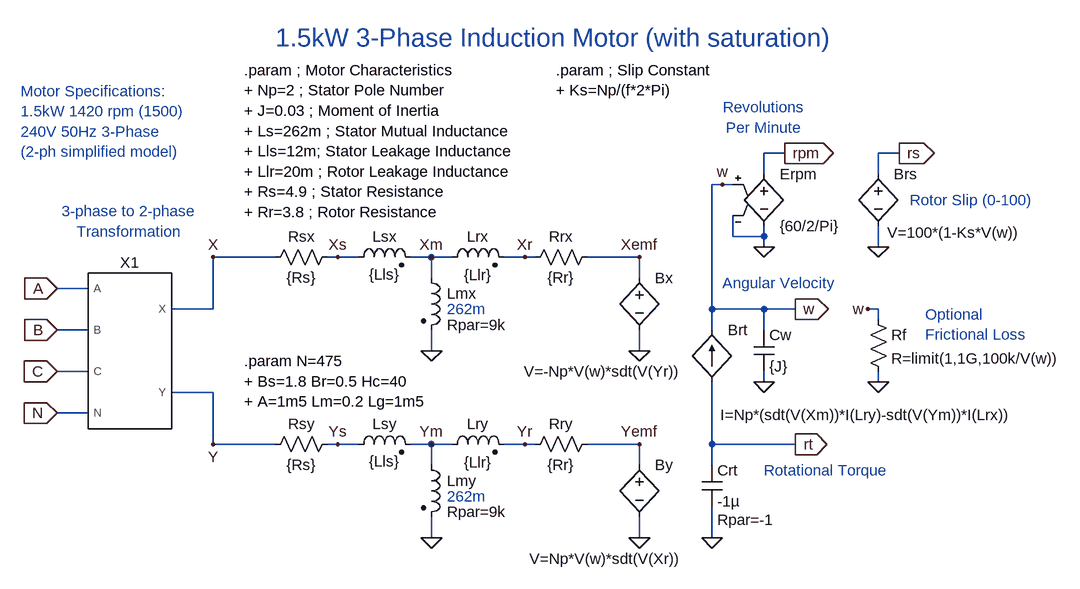
[diagram p0: schematic 3-PhaseMotor.asc]
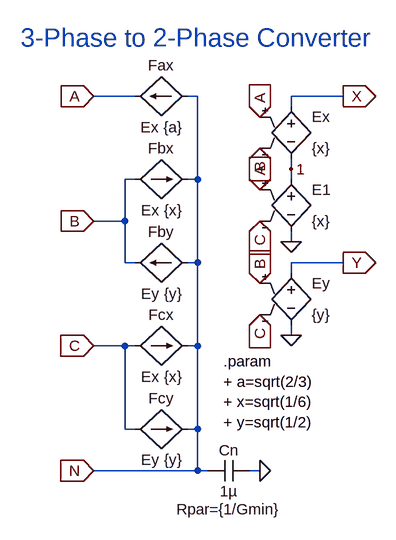
[diagram p1: sub-circuit 3to2xfmr.asc]
3-PhaseMotor.asc, the LTspice schematic file:
Version 4
SHEET 1 1896 836
WIRE 704 -96 672 -96
WIRE 880 -96 848 -96
WIRE 672 -64 672 -96
WIRE 848 -64 848 -96
WIRE 608 -48 592 -48
WIRE 624 -48 608 -48
WIRE 624 32 624 0
WIRE 672 32 672 16
WIRE 672 32 624 32
WIRE 672 48 672 32
WIRE 848 48 848 16
WIRE -80 64 -176 64
WIRE 16 64 0 64
WIRE 48 64 16 64
WIRE 160 64 128 64
WIRE 192 64 160 64
WIRE 304 64 272 64
WIRE 320 64 304 64
WIRE 480 64 400 64
WIRE 160 96 160 64
WIRE 480 96 480 64
WIRE -368 112 -416 112
WIRE -176 144 -176 64
WIRE -176 144 -240 144
WIRE 592 144 592 -48
WIRE 672 144 592 144
WIRE 720 144 672 144
WIRE 848 144 832 144
WIRE 848 160 848 144
WIRE -368 176 -416 176
WIRE 592 176 592 144
WIRE 672 176 672 144
WIRE 160 208 160 176
WIRE 480 208 480 176
WIRE -368 240 -416 240
WIRE 672 256 672 240
WIRE 848 256 848 240
WIRE -176 272 -240 272
WIRE -368 304 -416 304
WIRE -176 352 -176 272
WIRE -80 352 -176 352
WIRE 16 352 0 352
WIRE 48 352 16 352
WIRE 160 352 128 352
WIRE 192 352 160 352
WIRE 304 352 272 352
WIRE 320 352 304 352
WIRE 480 352 400 352
WIRE 592 352 592 256
WIRE 720 352 592 352
WIRE 160 384 160 352
WIRE 480 384 480 352
WIRE 592 384 592 352
WIRE 160 496 160 464
WIRE 480 496 480 464
WIRE 592 496 592 448
FLAG 160 496 0
FLAG 160 208 0
FLAG 704 -96 rpm
IOPIN 704 -96 Out
FLAG 720 144 w
IOPIN 720 144 Out
FLAG 720 352 rt
IOPIN 720 352 Out
FLAG 480 208 0
FLAG 480 496 0
FLAG 608 -48 w
FLAG 672 48 0
FLAG 672 256 0
FLAG 592 496 0
FLAG 160 64 Xm
FLAG 304 64 Xr
FLAG 160 352 Ym
FLAG 304 352 Yr
FLAG 16 64 Xs
FLAG 16 352 Ys
FLAG 480 64 Xemf
FLAG 480 352 Yemf
FLAG 848 48 0
FLAG 880 -96 rs
IOPIN 880 -96 Out
FLAG 832 144 w
FLAG 848 256 0
FLAG -176 64 X
FLAG -176 352 Y
FLAG -416 112 A
IOPIN -416 112 In
FLAG -416 176 B
IOPIN -416 176 In
FLAG -416 240 C
IOPIN -416 240 In
FLAG -416 304 N
IOPIN -416 304 In
SYMBOL res -96 80 R270
WINDOW 0 32 56 VTop 2
WINDOW 3 0 56 VBottom 2
SYMATTR InstName Rsx
SYMATTR Value {Rs}
SYMBOL ind2 32 80 R270
WINDOW 0 32 56 VTop 2
WINDOW 3 5 56 VBottom 2
SYMATTR InstName Lsx
SYMATTR Value {Lls}
SYMATTR Type ind
SYMATTR SpiceLine Rser=0
SYMBOL ind2 144 80 R0
WINDOW 0 40 40 Left 2
WINDOW 3 0 64 Invisible 2
WINDOW 39 40 88 Left 2
SYMATTR InstName Lmx
SYMATTR Value Bs={Bs} Br={Br} Hc={Hc} A={A} Lm={Lm} Lg={Lg} N={N}
SYMATTR SpiceLine Rpar=9k
SYMATTR Type ind
SYMBOL ind2 176 80 R270
WINDOW 0 32 56 VTop 2
WINDOW 3 4 56 VBottom 2
SYMATTR InstName Lrx
SYMATTR Value {Llr}
SYMATTR Type ind
SYMATTR SpiceLine Rser=0
SYMBOL res 304 80 R270
WINDOW 0 32 56 VTop 2
WINDOW 3 0 56 VBottom 2
SYMATTR InstName Rrx
SYMATTR Value {Rr}
SYMBOL bv 480 80 R0
WINDOW 3 64 160 Right 2
SYMATTR Value V=-Np*V(w)*sdt(V(Yr))
SYMATTR InstName Bx
SYMBOL res -96 368 R270
WINDOW 0 32 56 VTop 2
WINDOW 3 0 56 VBottom 2
SYMATTR InstName Rsy
SYMATTR Value {Rs}
SYMBOL ind2 32 368 R270
WINDOW 0 32 56 VTop 2
WINDOW 3 5 56 VBottom 2
SYMATTR InstName Lsy
SYMATTR Value {Lls}
SYMATTR Type ind
SYMATTR SpiceLine Rser=0
SYMBOL ind2 144 368 R0
WINDOW 0 40 40 Left 2
WINDOW 3 0 64 Invisible 2
WINDOW 39 40 88 Left 2
SYMATTR InstName Lmy
SYMATTR Value Bs={Bs} Br={Br} Hc={Hc} A={A} Lm={Lm} Lg={Lg} N={N}
SYMATTR SpiceLine Rpar=9k
SYMATTR Type ind
SYMBOL ind2 176 368 R270
WINDOW 0 32 56 VTop 2
WINDOW 3 4 56 VBottom 2
SYMATTR InstName Lry
SYMATTR Value {Llr}
SYMATTR Type ind
SYMATTR SpiceLine Rser=0
SYMBOL res 304 368 R270
WINDOW 0 32 56 VTop 2
WINDOW 3 0 56 VBottom 2
SYMATTR InstName Rry
SYMATTR Value {Rr}
SYMBOL bv 480 368 R0
WINDOW 3 64 160 Right 2
SYMATTR Value V=Np*V(w)*sdt(V(Xr))
SYMATTR InstName By
SYMBOL bi 592 256 M180
WINDOW 0 24 80 Left 2
WINDOW 3 13 -51 Left 2
SYMATTR InstName Brt
SYMATTR Value I=Np*(sdt(V(Xm))*I(Lry)-sdt(V(Ym))*I(Lrx))
SYMBOL cap 656 176 R0
SYMATTR InstName Cw
SYMATTR Value {J}
SYMBOL cap 576 384 R0
WINDOW 39 24 84 Left 2
SYMATTR SpiceLine Rpar=-1
SYMATTR InstName Crt
SYMATTR Value -1µ
SYMBOL res 832 144 R0
SYMATTR InstName Rf
SYMATTR Value R=limit(1,1G,100k/V(w))
SYMBOL e 672 -80 R0
SYMATTR InstName Erpm
SYMATTR Value {60/2/Pi}
SYMBOL bv 848 -80 R0
WINDOW 3 14 106 Left 2
SYMATTR Value V=100*(1-Ks*V(w))
SYMATTR InstName Brs
SYMBOL 3to2xfmr -304 208 R0
SYMATTR InstName X1
TEXT 352 -248 Bottom 4 ;1.5kW 3-Phase Induction Motor (with saturation)
TEXT -472 -192 Left 2 ;Motor Specifications:\n1.5kW 1420 rpm (1500)\n240V 50Hz 3-Phase\n(2-ph simplified model)
TEXT -128 -224 Left 2 !.param ; Motor Characteristics\n+ Np=2 ; Stator Pole Number\n+ J=0.03 ; Moment of Inertia\n+ Ls=262m ; Stator Mutual Inductance\n+ Lls=12m; Stator Leakage Inductance\n+ Llr=20m ; Rotor Leakage Inductance\n+ Rs=4.9 ; Stator Resistance\n+ Rr=3.8 ; Rotor Resistance
TEXT -128 224 Left 2 !.param N=475\n+ Bs=1.8 Br=0.5 Hc=40\n+ A=1m5 Lm=0.2 Lg=1m5
TEXT 352 -224 Left 2 !.param ; Slip Constant\n+ Ks=Np/(f*2*Pi)
TEXT 184 144 Left 2 ;262m
TEXT 184 432 Left 2 ;262m
TEXT 608 104 Left 2 ;Angular Velocity
TEXT 672 392 Left 2 ;Rotational Torque
TEXT 672 -120 Bottom 2 ;Revolutions\nPer Minute
TEXT 896 -24 Left 2 ;Rotor Slip (0-100)
TEXT 920 152 Left 2 ;Optional\nFrictional Loss
TEXT -304 40 Bottom 2 ;3-phase to 2-phase\nTransformation

3to2xfmr.asc, the sub-circuit schematic file:
Version 4
SHEET 1 880 680
WIRE 112 -304 48 -304
WIRE 208 -304 192 -304
WIRE 432 -304 352 -304
WIRE 352 -288 352 -304
WIRE 352 -192 352 -208
WIRE 112 -176 96 -176
WIRE 208 -176 208 -304
WIRE 208 -176 192 -176
WIRE 352 -176 352 -192
WIRE 96 -112 96 -176
WIRE 96 -112 48 -112
WIRE 352 -80 352 -96
WIRE 96 -48 96 -112
WIRE 112 -48 96 -48
WIRE 208 -48 208 -176
WIRE 208 -48 192 -48
WIRE 432 -48 352 -48
WIRE 352 -32 352 -48
WIRE 352 64 352 48
WIRE 96 80 48 80
WIRE 112 80 96 80
WIRE 208 80 208 -48
WIRE 208 80 192 80
WIRE 96 208 96 80
WIRE 112 208 96 208
WIRE 208 208 208 80
WIRE 208 208 192 208
WIRE 208 272 208 208
WIRE 208 272 48 272
WIRE 224 272 208 272
WIRE 304 272 288 272
FLAG 48 -304 A
IOPIN 48 -304 In
FLAG 48 -112 B
IOPIN 48 -112 In
FLAG 48 80 C
IOPIN 48 80 In
FLAG 352 -80 0
FLAG 304 272 0
FLAG 432 -304 X
IOPIN 432 -304 Out
FLAG 432 -48 Y
IOPIN 432 -48 Out
FLAG 48 272 N
IOPIN 48 272 In
FLAG 304 -272 A
IOPIN 304 -272 In
FLAG 304 -224 B
IOPIN 304 -224 In
FLAG 304 -112 C
IOPIN 304 -112 In
FLAG 304 -16 B
IOPIN 304 -16 In
FLAG 304 32 C
IOPIN 304 32 In
FLAG 304 -160 A
IOPIN 304 -160 In
FLAG 352 64 0
FLAG 352 -192 1
SYMBOL f 192 -304 M270
WINDOW 0 32 40 VTop 2
WINDOW 3 -32 40 VBottom 2
SYMATTR InstName Fax
SYMATTR Value Ex {a}
SYMBOL f 112 -176 R270
WINDOW 0 32 40 VTop 2
WINDOW 3 -32 40 VBottom 2
SYMATTR InstName Fbx
SYMATTR Value Ex {x}
SYMBOL f 192 -48 M270
WINDOW 0 32 40 VTop 2
WINDOW 3 -32 40 VBottom 2
SYMATTR InstName Fby
SYMATTR Value Ey {y}
SYMBOL f 112 80 R270
WINDOW 0 32 40 VTop 2
WINDOW 3 -32 40 VBottom 2
SYMATTR InstName Fcx
SYMATTR Value Ex {x}
SYMBOL f 112 208 R270
WINDOW 0 32 40 VTop 2
WINDOW 3 -32 40 VBottom 2
SYMATTR InstName Fcy
SYMATTR Value Ey {y}
SYMBOL e 352 -304 R0
WINDOW 0 32 32 Left 2
WINDOW 3 32 80 Left 2
SYMATTR InstName Ex
SYMATTR Value {x}
SYMBOL e 352 -192 R0
WINDOW 0 32 32 Left 2
WINDOW 3 32 80 Left 2
SYMATTR InstName E1
SYMATTR Value {x}
SYMBOL e 352 -48 R0
WINDOW 0 32 32 Left 2
WINDOW 3 32 80 Left 2
SYMATTR InstName Ey
SYMATTR Value {y}
SYMBOL cap 288 256 R90
WINDOW 0 0 32 VBottom 2
WINDOW 3 32 32 VTop 2
WINDOW 39 60 32 VTop 2
SYMATTR InstName Cn
SYMATTR Value 1µ
SYMATTR SpiceLine Rpar={1/Gmin}
TEXT 248 104 Left 2 !.param\n+ a=sqrt(2/3)\n+ x=sqrt(1/6)\n+ y=sqrt(1/2)
TEXT 208 -368 Bottom 4 ;3-Phase to 2-Phase Converter

The netlist it stands for:
* 3-PhaseMotor.asc
Rsx X Xs {Rs}
Lsx Xs Xm {Lls} Rser=0
Lmx Xm 0 Bs={Bs} Br={Br} Hc={Hc} A={A} Lm={Lm} Lg={Lg} N={N} Rpar=9k
Lrx Xm Xr {Llr} Rser=0
Rrx Xr Xemf {Rr}
Bx Xemf 0 V=-Np*V(w)*sdt(V(Yr))
Rsy Y Ys {Rs}
Lsy Ys Ym {Lls} Rser=0
Lmy Ym 0 Bs={Bs} Br={Br} Hc={Hc} A={A} Lm={Lm} Lg={Lg} N={N} Rpar=9k
Lry Ym Yr {Llr} Rser=0
Rry Yr Yemf {Rr}
By Yemf 0 V=Np*V(w)*sdt(V(Xr))
Brt rt w I=Np*(sdt(V(Xm))*I(Lry)-sdt(V(Ym))*I(Lrx))
Cw w 0 {J}
Crt rt 0 -1µ Rpar=-1
Rf w 0 R=limit(1,1G,100k/V(w))
Erpm rpm 0 w 0 {60/2/Pi}
Brs rs 0 V=100*(1-Ks*V(w))
XX1 A B C N X Y 3to2xfmr

* block symbol definitions
.subckt 3to2xfmr A B C N X Y
Fax N A Ex {a}
Fbx B N Ex {x}
Fby N B Ey {y}
Fcx C N Ex {x}
Fcy C N Ey {y}
Ex X 1 A B {x}
E1 1 0 A C {x}
Ey Y 0 B C {y}
Cn 0 N 1µ Rpar={1/Gmin}
.param
+ a=sqrt(2/3)
+ x=sqrt(1/6)
+ y=sqrt(1/2)
* 3-Phase to 2-Phase Converter
.ends 3to2xfmr

* 1.5kW 3-Phase Induction Motor (with saturation)
* Motor Specifications:
* 1.5kW 1420 rpm (1500)
* 240V 50Hz 3-Phase
* (2-ph simplified model)
.param ; Motor Characteristics
+ Np=2 ; Stator Pole Number
+ J=0.03 ; Moment of Inertia
+ Ls=262m ; Stator Mutual Inductance
+ Lls=12m; Stator Leakage Inductance
+ Llr=20m ; Rotor Leakage Inductance
+ Rs=4.9 ; Stator Resistance
+ Rr=3.8 ; Rotor Resistance
.param N=475
+ Bs=1.8 Br=0.5 Hc=40
+ A=1m5 Lm=0.2 Lg=1m5
.param ; Slip Constant
+ Ks=Np/(f*2*Pi)
* 262m
* 262m
* Angular Velocity
* Rotational Torque
* Revolutions
* Per Minute
* Rotor Slip (0-100)
* Optional
* Frictional Loss
* 3-phase to 2-phase
* Transformation
.backanno
.end